# Altium schematic sheet diy_stm.SchDoc
size A3
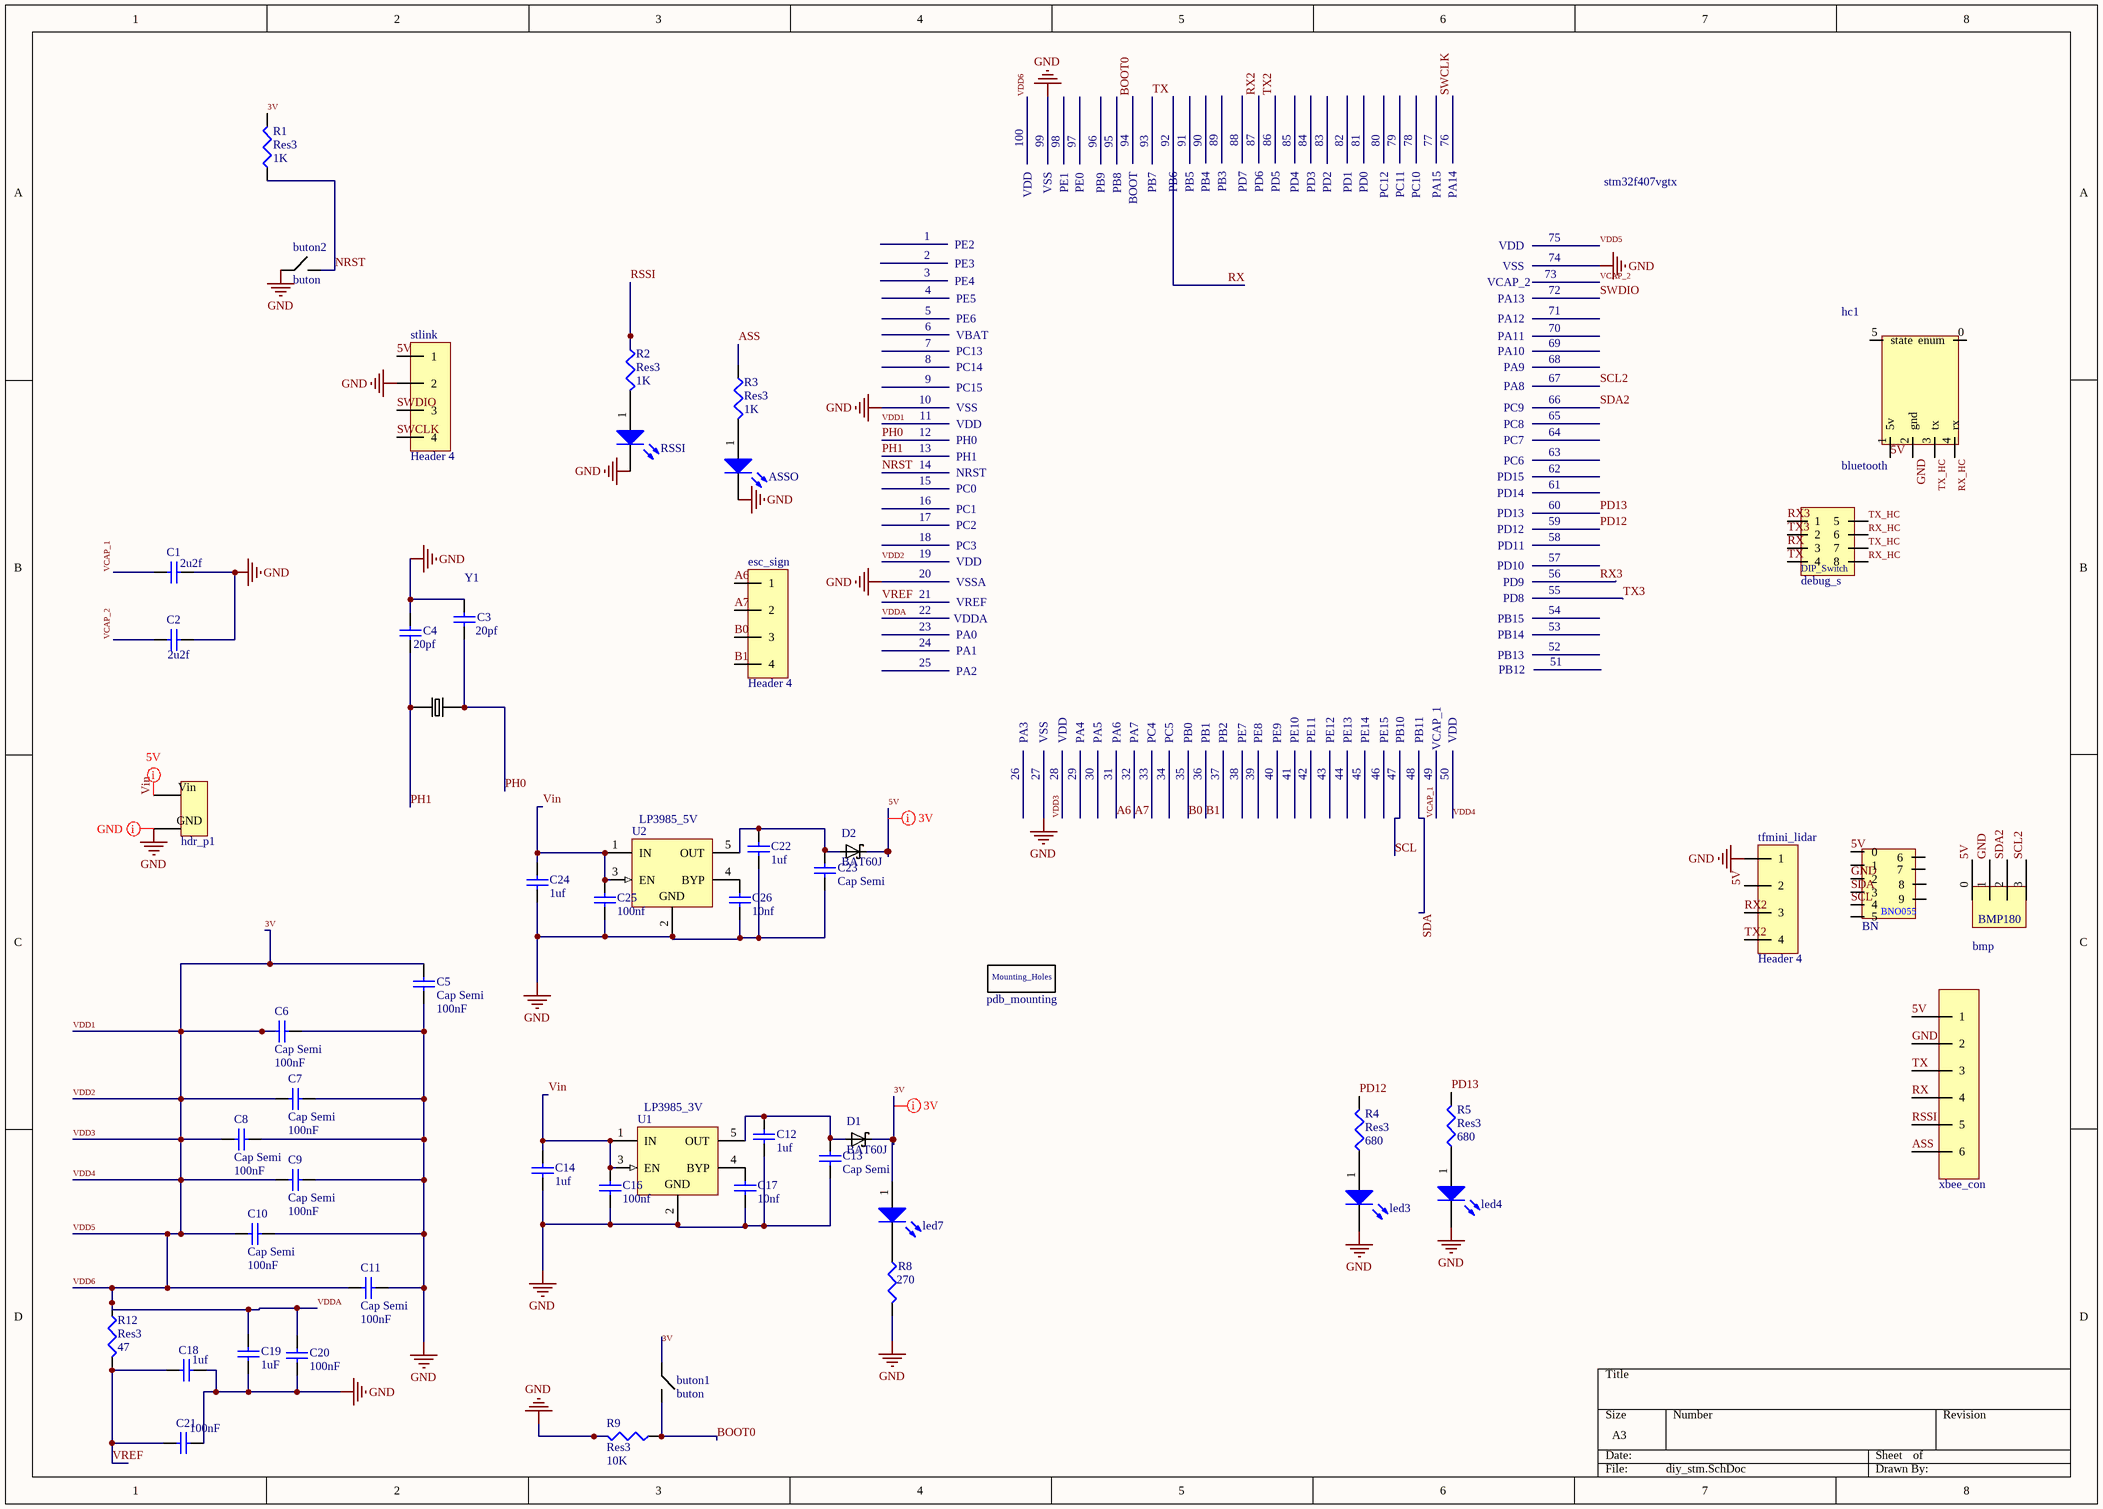
[diagram p0: diy_stm.SchDoc]

## Parts
ASSO  L_green  [LED_0603]  (value not drawn)
bmp  bmp  [bmp]  (value not drawn)
BN  BNO055  [bno055]  (value not drawn)
buton1  buton  [buton]
buton2  buton  [buton]
C1  value 2u2f  [0603]  (hidden comment: Cap Semi)
C2  value 2u2f  [0603]  (hidden comment: Cap Semi)
C3  value 20pf  [0603]  (hidden comment: Cap Semi)
C4  value 20pf  [0603]  (hidden comment: Cap Semi)
C5  Cap Semi  value 100nF  [0603]
C6  Cap Semi  value 100nF  [0603]
C7  Cap Semi  value 100nF  [0603]
C8  Cap Semi  value 100nF  [0603]
C9  Cap Semi  value 100nF  [0603]
C10  Cap Semi  value 100nF  [0603]
C11  Cap Semi  value 100nF  [0603]
C12  1uf  [0603]
C13  Cap Semi  [0603]
C14  1uf  [0603]
C16  100nf  [0603]
C17  10nf  [0603]
C18  value 1uf  [0603]  (hidden comment: Cap Semi)
C19  value 1uF  [0603]  (hidden comment: Cap Semi)
C20  value 100nF  [0603]  (hidden comment: Cap Semi)
C21  value 100nF  [0603]  (hidden comment: Cap Semi)
C22  1uf  [0603]
C23  Cap Semi  [0603]
C24  1uf  [0603]
C25  100nf  [0603]
C26  10nf  [0603]
D1  BAT60J  [*SOD323_ST_BAT60J(Primary)]
D2  BAT60J  [*SOD323_ST_BAT60J(Primary)]
debug_s  dipswitch  [jumer4_1.27]  (value not drawn)
esc_sign  Header 4  [hdr4_1.27]
hc1  bluetooth  [hc05]
hdr_p1  header_2_power  [HDR2_POWER]  (value not drawn)
led3  L_green  [LED_0603]  (value not drawn)
led4  L_green  [LED_0603]  (value not drawn)
led7  L_green  [LED_0603]  (value not drawn)
pdb_mounting  pdb_mounting  [pdb_mounting_v1]  (value not drawn)
R1  Res3  value 1K  [J1-0603]
R2  Res3  value 1K  [J1-0603]
R3  Res3  value 1K  [J1-0603]
R4  Res3  value 680  [J1-0603]
R5  Res3  value 680  [J1-0603]
R8  value 270  [J1-0603]  (hidden comment: Res3)
R9  Res3  value 10K  [J1-0603]
R12  Res3  value 47  [J1-0603]
RSSI  L_green  [LED_0603]  (value not drawn)
stlink  Header 4  [hdr4_1.27]
stm32f407vgtx  stm  [*QFP50P1600X1600X160-100N]  (value not drawn)
tfmini_lidar  Header 4  [hdr4_1.27]
U1  LP3985_3V  [MF05A_M]
U2  LP3985_5V  [MF05A_M]
xbee_con  header_6  [hdr6_1.27]  (value not drawn)
Y1  ECS-122.8-20-1X  [*XTAL_ECS-122.8-20-1X]  (value not drawn)

## Nets
GND: ASSO.2(K) bmp.1 BN.2 buton2.1 C1.1 C2.1 C3.1 C4.1 C5.2 C6.2 C7.2 C8.2 C9.2 C10.2 C11.2 C12.1 C13.1 C14.1 C16.1 C17.1 C18.2 C19.1 C20.1 C21.2 C22.1 C23.1 C24.1 C25.1 C26.1 hc1.2(gnd) hdr_p1.GND led3.2(K) led4.2(K) R8.2 R9.2 RSSI.2(K) stlink.2 stm32f407vgtx.10(VSS) stm32f407vgtx.20(VSSA) stm32f407vgtx.27(VSS) stm32f407vgtx.74(VSS) stm32f407vgtx.99(VSS) tfmini_lidar.1 U1.2(GND) U2.2(GND) xbee_con.2
3V: buton1.1 C5.1 C6.1 C7.1 C8.1 C9.1 C10.1 C11.1 C19.2 C20.2 D1.C led7.1(V) R1.2 R12.1 stm32f407vgtx.11(VDD) stm32f407vgtx.19(VDD) stm32f407vgtx.22(VDDA) stm32f407vgtx.28(VDD) stm32f407vgtx.50(VDD) stm32f407vgtx.75(VDD) stm32f407vgtx.100(VDD)  [also labelled VDD1, VDD2, VDD3, VDD4, VDD5, VDD6, VDDA]
5V: bmp.0 BN.0 D2.C hc1.1(5v) stlink.1 tfmini_lidar.2 xbee_con.1
A6: esc_sign.1 stm32f407vgtx.31(PA6)
A7: esc_sign.2 stm32f407vgtx.32(PA7)
ASS: R3.1 xbee_con.6
B0: esc_sign.3 stm32f407vgtx.35(PB0)
B1: esc_sign.4 stm32f407vgtx.36(PB1)
BOOT0: buton1.2 R9.1 stm32f407vgtx.94(BOOT)
NRST: buton2.2 R1.1 stm32f407vgtx.14(NRST)
PD12: R4.2 stm32f407vgtx.59(PD12)
PD13: R5.2 stm32f407vgtx.60(PD13)
PH0: C3.2 stm32f407vgtx.12(PH0) Y1.1
PH1: C4.2 stm32f407vgtx.13(PH1) Y1.2
RSSI: R2.1 xbee_con.5
RX: debug_s.3 stm32f407vgtx.92(PB6) xbee_con.4
RX2: stm32f407vgtx.87(PD6) tfmini_lidar.3
RX3: debug_s.1 stm32f407vgtx.56(PD9)
RX_HC: debug_s.6 debug_s.8 hc1.4(rx)
SCL: BN.4 stm32f407vgtx.47(PB10)
SCL2: bmp.3 stm32f407vgtx.67(PA8)
SDA: BN.3 stm32f407vgtx.48(PB11)
SDA2: bmp.2 stm32f407vgtx.66(PC9)
SWCLK: stlink.4 stm32f407vgtx.76(PA14)
SWDIO: stlink.3 stm32f407vgtx.72(PA13)
TX: debug_s.4 stm32f407vgtx.93(PB7) xbee_con.3
TX2: stm32f407vgtx.86(PD5) tfmini_lidar.4
TX3: debug_s.2 stm32f407vgtx.55(PD8)
TX_HC: debug_s.5 debug_s.7 hc1.3(tx)
VCAP_1: C1.2 stm32f407vgtx.49(VCAP_1)
VCAP_2: C2.2 stm32f407vgtx.73(VCAP_2)
Vin: C14.2 C16.2 C24.2 C25.2 hdr_p1.Vin U1.1(IN) U1.3(EN) U2.1(IN) U2.3(EN)
VREF: C18.1 C21.1 R12.2 stm32f407vgtx.21(VREF)
NetASSO_1: ASSO.1(V) R3.2
NetC12_2: C12.2 C13.2 D1.A U1.5(OUT)
NetC17_2: C17.2 U1.4(BYP)
NetC22_2: C22.2 C23.2 D2.A U2.5(OUT)
NetC26_2: C26.2 U2.4(BYP)
Netled3_1: led3.1(V) R4.1
Netled4_1: led4.1(V) R5.1
Netled7_2: led7.2(K) R8.1
NetR2_2: R2.2 RSSI.1(V)

Not connected (* = marked no-connect by the designer): BN 1 5 6 7 8 9; hc1 0(enum) 5(state); stm32f407vgtx 1(PE2) 2(PE3) 3(PE4) 4(PE5) 5(PE6) 6(VBAT) 7(PC13) 8(PC14) 9(PC15) 15(PC0) 16(PC1) 17(PC2) 18(PC3) 23(PA0) 24(PA1) 25(PA2) 26(PA3) 29(PA4) 30(PA5) 33(PC4) 34(PC5) 37(PB2) 38(PE7) 39(PE8) 40(PE9) 41(PE10) 42(PE11) 43(PE12) 44(PE13) 45(PE14) 46(PE15) 51(PB12) 52(PB13) 53(PB14) 54(PB15) 57(PD10) 58(PD11) 61(PD14) 62(PD15) 63(PC6) 64(PC7) 65(PC8) 68(PA9) 69(PA10) 70(PA11) 71(PA12) 77(PA15) 78(PC10) 79(PC11) 80(PC12) 81(PD0) 82(PD1) 83(PD2) 84(PD3) 85(PD4) 88(PD7) 89(PB3) 90(PB4) 91(PB5) 95(PB8) 96(PB9) 97(PE0) 98(PE1)

## Layout directives
net class Undefined; rule Undefined; width: rule; rule Width Constraint [Pref Width = 6mil    Min Width = 6mil    Max Width = 7mil]; rule Routing Layers [TopLayer - DisabledBottomLayer - Disabled]; rule Routing Layers [TopLayer - DisabledBottomLayer - Disabled]: GND
net class Undefined; rule Width Constraint [Pref Width = 6mil    Min Width = 6mil    Max Width = 6mil]; rule Routing Layers [TopLayer - Enabled BottomLayer - Enabled ]: 3V, 5V, Vin

## Notes on the sheet
- (in symbol bmp) BMP180
- (in symbol dipswitch) DIP_Switch
- (in symbol pdb_mounting) Mounting_Holes

## Library data of the parts
C1-C11 C18-C21 = Cap Semi: Capacitor (Semiconductor SIM Model); Published: 8-Jun-2000; LatestRevisionDate: 29-May-2009; LatestRevisionNote: IPC-7351 Footprint Added.; PackageReference: C1206; Publisher: Altium Limited; PackageDescription: Chip Capacitor
C12-C14 C16 C17 C22-C26 = Cap Semi: Capacitor (Semiconductor SIM Model); Value: 100pF; Published: 8-Jun-2000; LatestRevisionDate: 29-May-2009; LatestRevisionNote: IPC-7351 Footprint Added.; PackageReference: C1206; Publisher: Altium Limited; PackageDescription: Chip Capacitor
D1 D2 = BAT60J: MF: STMicroelectronics; Package: None; MP: BAT60J; SnapEDA_Link: https://www.snapeda.com/parts/BAT60J/STMicroelectronics/view-part/?ref=snap; Availability: Unavailable; Price: None; Value: *
hc1 = hc05: bluetooth device hc 05
R1-R5 R8 R9 R12 = Res3: Resistor; Published: 8-Jun-2000; LatestRevisionDate: 29-May-2009; LatestRevisionNote: IPC-7351 Footprint Added.; PackageReference: J1-0603; Publisher: Altium Limited; PackageDescription: Chip Resistor
stm32f407vgtx = stm32f407
U1 U2 = LP3985IM5-2.9: Micropower, 150mA Low-Noise Ultra Low-Dropout CMOS Voltage Regulator, 5-pin SOT-23; Manufacturer: National Semiconductor; PackageTopMarking: LCYB*XTT; PowerWise: N; CompType: LDO IC; PinCount: 5; DatasheetVersion: Aug-2005; PackageVersion: revD, Aug-2008; PackageReference: MF05A; PackageDescription: Molded SOT-23, .115 x .063 x .040 in Body, 5 Lead, .0375 in Pitch; RoHS: Y; PartNumber: LP3985IM5-2.9
Y1 = ECS-122.8-20-1X: HC-49/U Microprocessor Crystals 12.288MHz 20pF; MF: ECS Inc.; Availability: Unavailable; Price: None; Package: HC49/U ECS International; SnapEDA_Link: https://www.snapeda.com/parts/ECS-122.8-20-1X/ECS%20Inc./view-part/?ref=snap; MP: ECS-122.8-20-1X; Value: *